# EAGLE design SparkFun_Qwiic_Accelerometer_BMA400 (EAGLE 9.6.2)
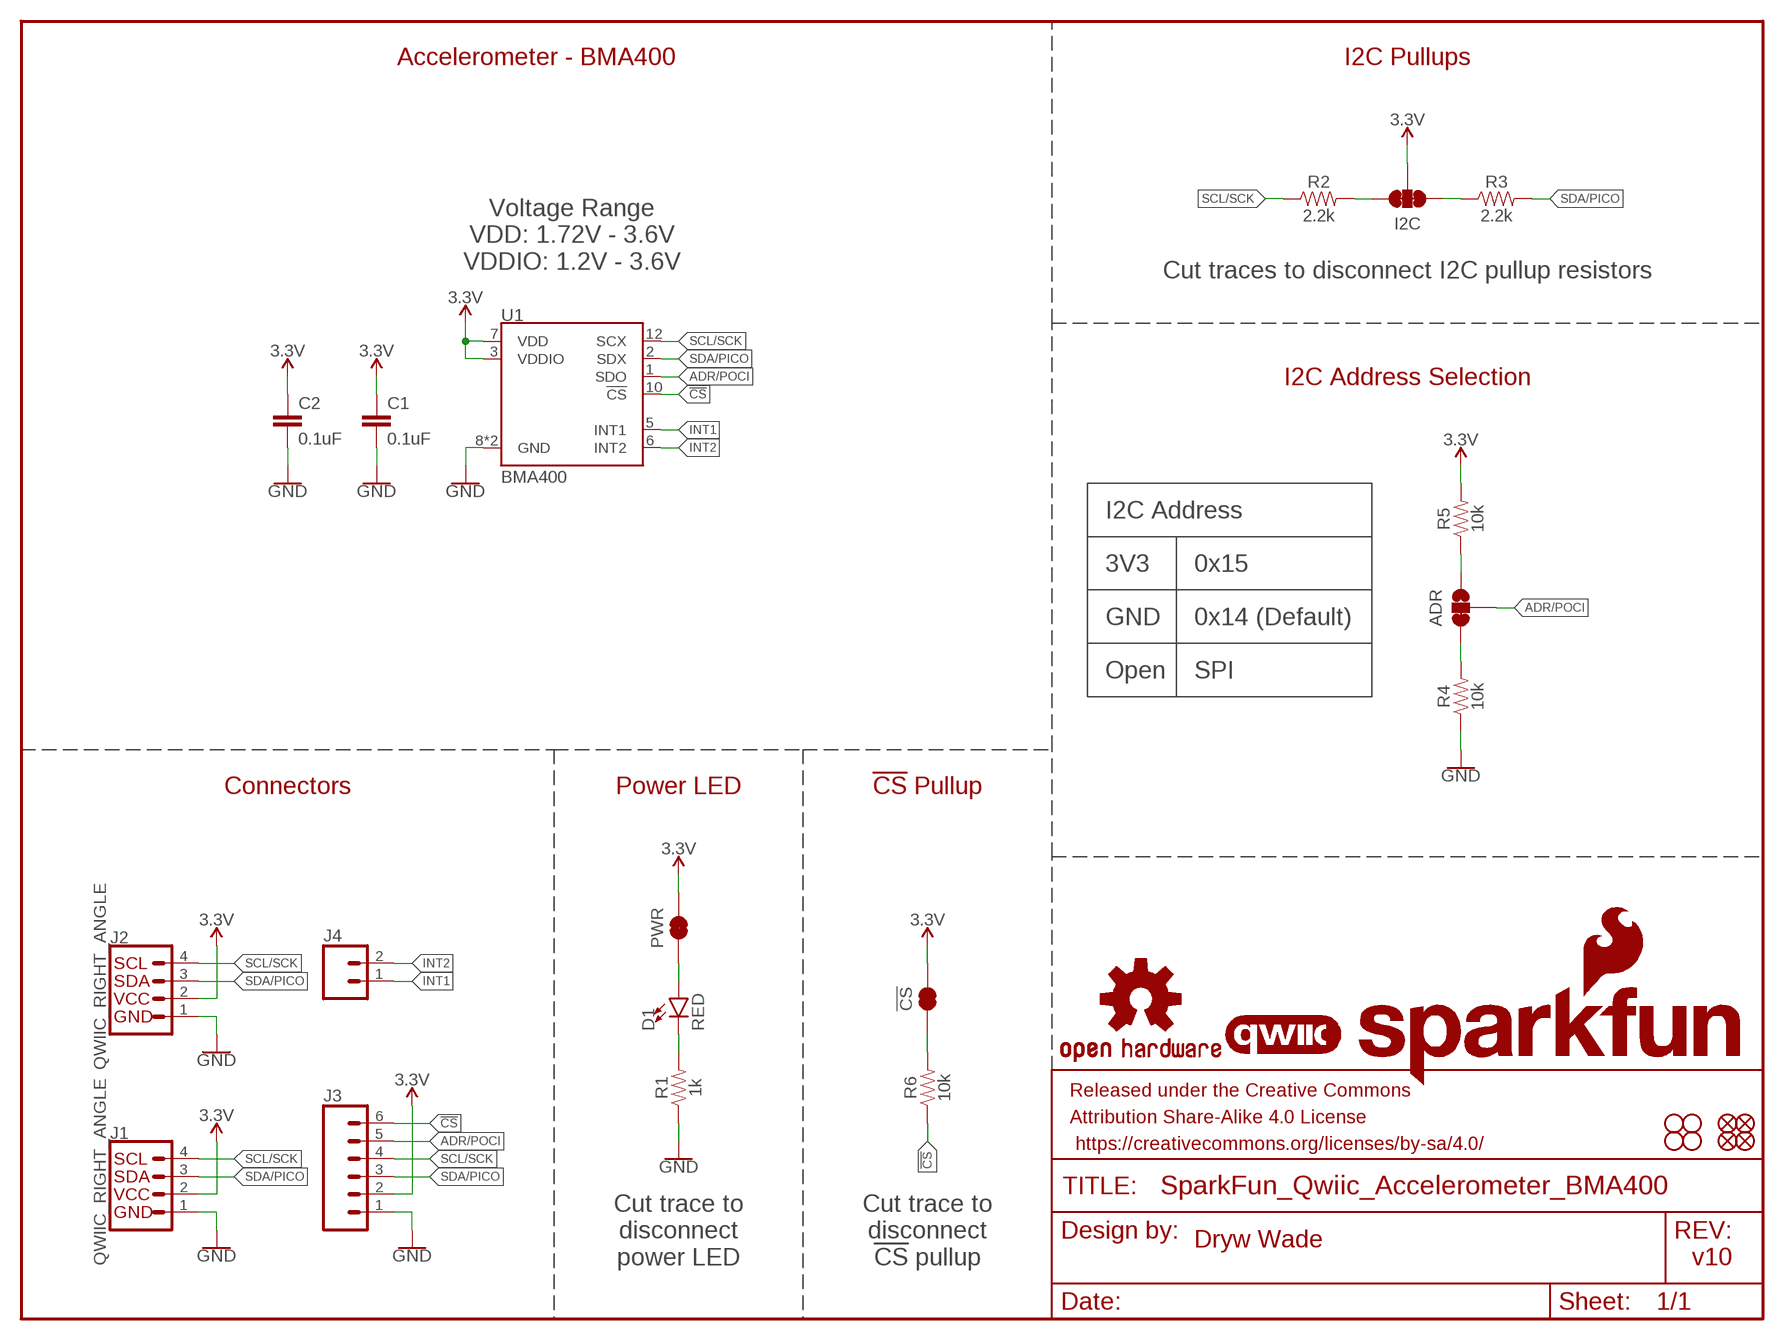
[diagram p0: schematic, sheet 1]

## Parts
!CS!  JUMPER-SMT_2_NC_TRACE_SILK  [SMT-JUMPER_2_NC_TRACE_SILK]
ADR  JUMPER-SMT_3_1-NC_TRACE_SILK  [SMT-JUMPER_3_1-NC_TRACE_SILK]
C1  0.1uF  0.1UF-0603-25V-(+80/-20%)  [0603]
C2  0.1uF  0.1UF-0603-25V-(+80/-20%)  [0603]
D1  RED  LED-RED0603  [LED-0603]
FD1  FIDUCIAL1X2  [FIDUCIAL-1X2]
FD2  FIDUCIAL1X2  [FIDUCIAL-1X2]
FD3  FIDUCIAL1X2  [FIDUCIAL-1X2]
FD4  FIDUCIAL1X2  [FIDUCIAL-1X2]
FRAME1  FRAME-LETTER  [CREATIVE_COMMONS]
H1  STAND-OFF  [STAND-OFF]
H2  STAND-OFF  [STAND-OFF]
H3  STAND-OFF  [STAND-OFF]
H4  STAND-OFF  [STAND-OFF]
I2C  JUMPER-SMT_3_2-NC_TRACE_SILK  [SMT-JUMPER_3_2-NC_TRACE_SILK]
J1  QWIIC_RIGHT_ANGLE  QWIIC_CONNECTORJS-1MM  [JST04_1MM_RA]
J2  QWIIC_RIGHT_ANGLE  QWIIC_CONNECTORJS-1MM  [JST04_1MM_RA]
J3  CONN_06NO_SILK_NO_POP  [1X06_NO_SILK]
J4  CONN_021X02_NO_SILK  [1X02_NO_SILK]
LOGO1  QWIIC_LOGO_5MM  [QWIIC_5MM]
LOGO2  SFE_LOGO_NAME_FLAME.1_INCH  [SFE_LOGO_NAME_FLAME_.1]
LOGO3  OSHW-LOGOS  [OSHW-LOGO-S]
PWR  JUMPER-SMT_2_NC_TRACE_SILK  [SMT-JUMPER_2_NC_TRACE_SILK]
R1  1k  1KOHM-0603-1/10W-1%  [0603]
R2  2.2k  2.2KOHM-0603-1/10W-1%  [0603]
R3  2.2k  2.2KOHM-0603-1/10W-1%  [0603]
R4  10k  10KOHM-0603-1/10W-1%  [0603]
R5  10k  10KOHM-0603-1/10W-1%  [0603]
R6  10k  10KOHM-0603-1/10W-1%  [0603]
U1  BMA400  [BMA400]

## Nets
3.3V: !CS!.2 C1.1 C2.1 I2C.2 J1.2 J2.2 J3.2 PWR.2 R5.2 U1.3(VDDIO) U1.7(VDD)
!CS!: J3.6 R6.1 U1.10(!CS!)
ADR/POCI: ADR.2 J3.5 U1.1(SDO)
GND: C1.2 C2.2 J1.1 J2.1 J3.1 R1.1 R4.1 U1.8(GND) U1.9(GND)
INT1: J4.1 U1.5(INT1)
INT2: J4.2 U1.6(INT2)
N$1: D1.A PWR.1
N$2: D1.C R1.2
N$3: I2C.3 R2.2
N$4: I2C.1 R3.1
N$5: ADR.1 R5.1
N$6: ADR.3 R4.2
N$7: !CS!.1 R6.2
SCL/SCK: J1.4 J2.4 J3.4 R2.1 U1.12(SCX)
SDA/PICO: J1.3 J2.3 J3.3 R3.2 U1.2(SDX)

## Notes on the sheet
- Accelerometer - BMA400 | I2C Pullups
- Voltage Range
  VDD: 1.72V - 3.6V
  VDDIO: 1.2V - 3.6V
- Cut traces to disconnect I2C pullup resistors
- I2C Address Selection
- I2C Address
- 3V3 | 0x15
- GND | 0x14 (Default)
- Open | SPI
- Connectors | Power LED | !CS! Pullup
- Cut trace to
  disconnect
  power LED
- Cut trace to
  disconnect
  !CS! pullup
- Dryw Wade
- v10

## Library data of the parts
!CS! PWR = SparkFun-Jumpers:JUMPER-SMT_2_NC_TRACE: Normally closed trace jumper This jumper has a trace between two pads so it's normally closed (NC). Use a razor knife to open the connection. For best results follow the IPC guidelines for cutting traces: Cutout at least 0.063 mm (0.005 in). Remove all loose material to clean up the cut area. Seal the cut with an approved epoxy. Reapply solder to reclose the connection.
ADR = SparkFun-Jumpers:JUMPER-SMT_3_1-NC_TRACE: Normally closed trace jumper (1 of 2 connections) This jumper has a trace between two pads so it's normally closed (NC). The other connection is normally open (NO). Use a razor knife to open the connection. For best results follow the IPC guidelines for cutting traces: Cutout at least 0.063 mm (0.005 in). Remove all loose material to clean up the cut area. Seal the cut with an approved epoxy. Reapply solder to reclose the connection, or to close the NO connection.
C1 C2 = SparkFun-Capacitors:0.1UF: 0.1µF ceramic capacitors A capacitor is a passive two-terminal electrical component used to store electrical energy temporarily in an electric field.; PROD_ID: CAP-00810
D1 = SparkFun-LED:LED-RED: Red SMD LED Used in manufacturing of most products at SparkFun Packages: 0603 - SMD 0603 package [Product Link] <http://docs.avagotech.com/docs/AV02-0551EN> 0603 SMART - SMD 0603 SMART package ( more efficient and expensive)[Product Link] <http://www.osram-os.com/Graphics/XPic2/00077099_0.pdf> 1206 - SMD1206 package [Product Link] <https://www.sparkfun.com/datasheets/DevTools/LilyPad/Q150OVS4.pdff> SparkFun Products: Pro Mini 328 -5V <https://www.sparkfun.com/products/821> RedBoard <https://www.sparkfun.com/products/12757> IOIO-OTG <https://www.sparkfun.com/products/13613>; PROD_ID: DIO-00819
FD1-FD4 = SparkFun-Aesthetics:FIDUCIAL: Fiducial Alignment Points Point-of-reference for pick-and-place machines and other optical instruments.
FRAME1 = SparkFun-Aesthetics:FRAME-LETTER: Schematic Frame - Letter Standard 8.5x11 US Letter frame
H1-H4 = SparkFun-Hardware:STAND-OFF: Stand Off Drill holes for mechanically mounting via screws, standoffs, etc. Note: Use the keepout ring to avoid running the screw head into surrounding components. Variant Overviews STAND-OFF - Mechanical footprint for a #4 phillips button head screw. STAND-OFF-TIGHT - Mechanical footprint for a #4 phillips button head screw, Example SparkFun Products Screw - Phillips Head (1/4", 4-40, 10 pack) <https://www.sparkfun.com/products/10453> (PRT-10453) Screw - Phillips Head (1/2", 4-40, 10 pack) <https://www.sparkfun.com/products/10452> (PRT-10452) Screw - Phillips Head (3/4", 4-40, 10 pack) <https://www.sparkfun.com/products/10451> (PRT-10451) Screw - Phillips Head (1", 4-40, 10 pack) <https://www.sparkfun.com/products/10450> (PRT-10450)
I2C = SparkFun-Jumpers:JUMPER-SMT_3_2-NC_TRACE: Normally closed trace jumper (2 of 2 connections) This jumper has a trace between all three pads so they are normally closed (NC). Use a razor knife to open the connection(s). For best results follow the IPC guidelines for cutting traces: Cutout at least 0.063 mm (0.005 in). Remove all loose material to clean up the cut area. Seal the cut with an approved epoxy. Reapply solder to reclose the connection(s).
J1 J2 = SparkFun-Connectors:QWIIC_CONNECTOR: SparkFun I2C Standard Qwiic Connector An SMD 1mm pitch JST connector makes it easy and quick (get it? Qwiic?) to connect I2C devices to each other. The Qwiic system <http://www.sparkfun.com/qwiic> enables fast and solderless connection between popular platforms and various sensors and actuators. We carry 200mm <https://www.sparkfun.com/products/14204>, 100mm <https://www.sparkfun.com/products/14205>, 50mm <https://www.sparkfun.com/products/14206>, and breadboard friendly <https://www.sparkfun.com/products/14207> Qwiic cables. We also offer 10 pcs strips <https://www.sparkfun.com/products/14323> the SMD connectors.; PROD_ID: CONN-13694
J3 = SparkFun-Connectors:CONN_06: Multi connection point. Often used as Generic Header-pin footprint for 0.1 inch spaced/style header connections On any of the 0.1 inch spaced packages, you can populate with these: Break Away Headers - Straight <https://www.sparkfun.com/products/116> (PRT-00116) Break Away Male Headers - Right Angle <https://www.sparkfun.com/products/553> (PRT-00553) Female Headers <https://www.sparkfun.com/products/115> (PRT-00115) Break Away Headers - Machine Pin <https://www.sparkfun.com/products/117> (PRT-00117) Break Away Female Headers - Swiss Machine Pin <https://www.sparkfun.com/products/743> (PRT-00743) Arduino Stackable Header - 6 Pin <https://www.sparkfun.com/products/9280> (PRT-09280) Screw Terminals 2.54mm Pitch (6-Pin) <https://www.sparkfun.com/products/16499> (PRT-16499) For SCREWTERMINALS and SPRING TERMINALS visit here: Screw Terimnals on SparkFun.com <https://www.sparkfun.com/search/results?term=Screw+Terminals> (5mm/3.5mm/2.54mm spacing) This device is also useful as a general connection point to wire up your design to another part of your project. Our various solder wires solder well into these plated through hole pads. Hook-Up Wire - Assortment (Stranded, 22 AWG) <https://www.sparkfun.com/products/11375> (PRT-11375) Hook-Up Wire - Assortment (Solid Core, 22 AWG) <https://www.sparkfun.com/products/11367> (PRT-11367) View the entire wire category on our website here <https://www.sparkfun.com/categories/141>
J4 = SparkFun-Connectors:CONN_02: Multi connection point. Often used as Generic Header-pin footprint for 0.1 inch spaced/style header connections On any of the 0.1 inch spaced packages, you can populate with these: Break Away Headers - Straight <https://www.sparkfun.com/products/116> (PRT-00116) Break Away Male Headers - Right Angle <https://www.sparkfun.com/products/553> (PRT-00553) Female Headers <https://www.sparkfun.com/products/115> (PRT-00115) Break Away Headers - Machine Pin <https://www.sparkfun.com/products/117> (PRT-00117) Break Away Female Headers - Swiss Machine Pin <https://www.sparkfun.com/products/743> (PRT-00743) For SCREWTERMINALS and SPRING TERMINALS visit here: Screw Terimnals on SparkFun.com <https://www.sparkfun.com/search/results?term=Screw+Terminals> (5mm/3.5mm/2.54mm spacing) This device is also useful as a general connection point to wire up your design to another part of your project. Our various solder wires solder well into these plated through hole pads. Hook-Up Wire - Assortment (Stranded, 22 AWG) <https://www.sparkfun.com/products/11375> (PRT-11375) Hook-Up Wire - Assortment (Solid Core, 22 AWG) <https://www.sparkfun.com/products/11367> (PRT-11367) View the entire wire category on our website here <https://www.sparkfun.com/categories/141> Special notes: Molex polarized connector foot print use with: PRT-08233 with associated crimp pins and housings. 2.54_SCREWTERM for use with PRT-10571. 3.5mm Screw Terminal footprints for PRT-08084 5mm Screw Terminal footprints for use with PRT-08432
LOGO1 = SparkFun-Aesthetics:QWIIC_LOGO: Qwiic Logos for placement on schematic and PCB. The 5.5mm silk logo is best for placing next to Qwiic connector.
LOGO2 = SparkFun-Aesthetics:SFE_LOGO_NAME_FLAME: SparkFun Font Logo w/ Flame This is the SparkFun full logo. The logo on the schematic will always be the same size; the package variant is the height of the flame part of the logo. Default layer for the logo on the board is tSilk.
LOGO3 = SparkFun-Aesthetics:OSHW-LOGO: Open-Source Hardware (OSHW) Logo This logo indicates the piece of hardware it is found on incorporates a OSHW license and/or adheres to the definition of open source hardware found here: http://freedomdefined.org/OSHW
R1 = SparkFun-Resistors:1KOHM: 1kΩ resistor A resistor is a passive two-terminal electrical component that implements electrical resistance as a circuit element. Resistors act to reduce current flow, and, at the same time, act to lower voltage levels within circuits. - Wikipedia; PROD_ID: RES-07856
R2 R3 = SparkFun-Resistors:2.2KOHM: 2.2kΩ resistor A resistor is a passive two-terminal electrical component that implements electrical resistance as a circuit element. Resistors act to reduce current flow, and, at the same time, act to lower voltage levels within circuits. - Wikipedia; PROD_ID: RES-08272
R4-R6 = SparkFun-Resistors:10KOHM: 10kΩ resistor A resistor is a passive two-terminal electrical component that implements electrical resistance as a circuit element. Resistors act to reduce current flow, and, at the same time, act to lower voltage levels within circuits. - Wikipedia; PROD_ID: RES-00824
U1 = SparkFun-Sensors:BMA400: Bosch BMA400 Accelerometer Senses acceleration with 12-bit resolution up to 16g, sends data out over I2C or SPI; PROD_ID: IC-17118

## Board
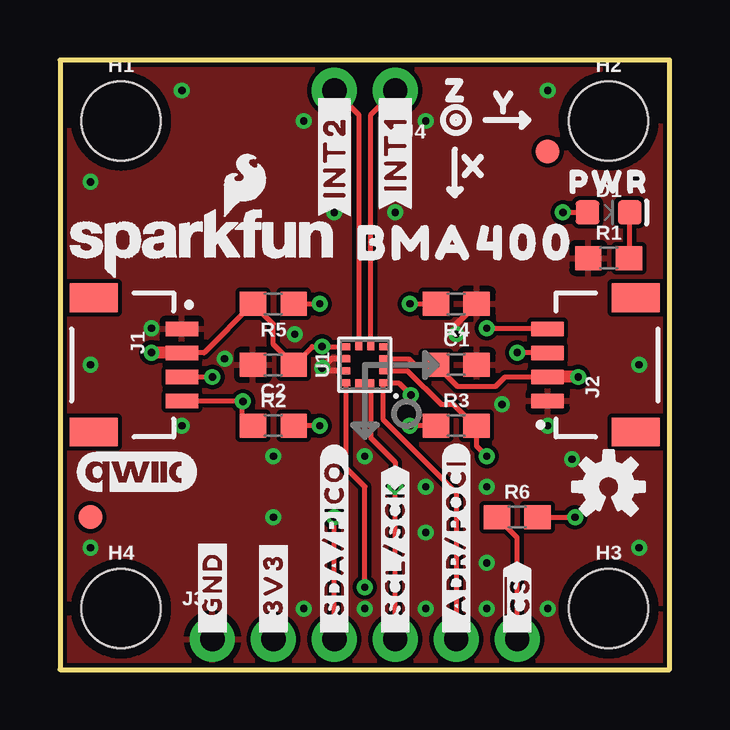
[diagram p1: board, top side]
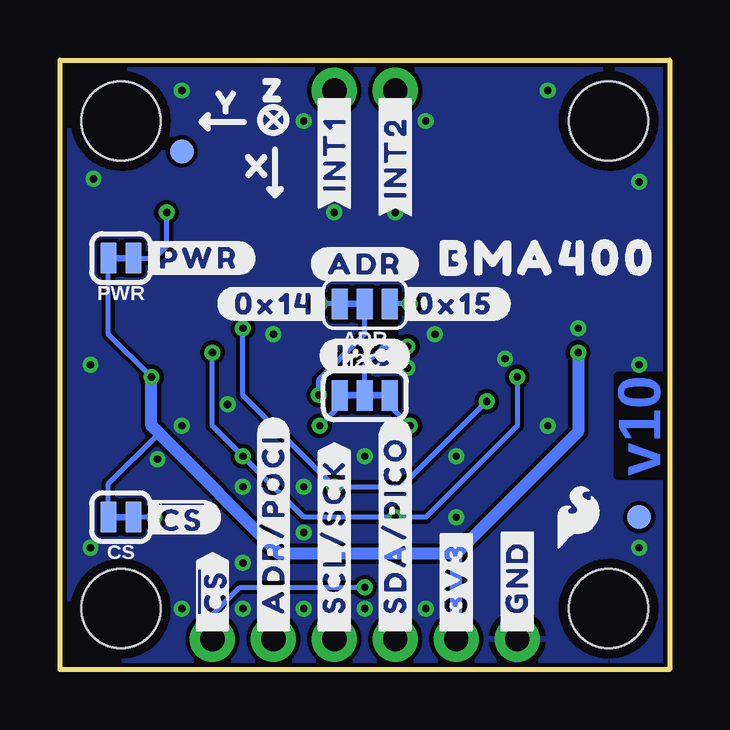
[diagram p2: board, bottom side, seen from below]

Size 25.4 x 25.4 mm. Coordinates in mm from the lower left corner, seen from the top.
Outline: 0,0 25.4,0 25.4,25.4 0,25.4 0,0
Copper layers (1*16): Top 0.035mm / dielectric 1.5mm / Bottom 0.035mm
Design rules "SparkFun-2-Layer-General-JLCPCB": minimum track width 7mil, minimum drill 0.3mm, track to track 7mil, track to pad 7mil, pad to pad 7mil, via to via 7mil, smd to smd 7mil, copper to edge 7mil, drill to drill 7mil, minimum pad ring 7mil, minimum via ring 7mil, stop-mask expansion 3mil, vias tented up to drill 25mil, thermal gap 10mil
tRestrict: area 11.9,12.7 to 12,12.8
bRestrict: area 11.4,13.7 to 11.7,14.4

### Footprints (pad centres in the part's own frame; a part is rotated, then mirrored left to right if it is on the bottom)
SMT-JUMPER_2_NC_TRACE_SILK = smd 0.66 x 1.27: 1 -0.521,0; 2 0.521,0
SMT-JUMPER_3_1-NC_TRACE_SILK = smd 0.66 x 1.27: 1 -1.041,0; 2 0,0; 3 1.041,0
0603 = smd 1.1 x 1: 1 -0.85,0; 2 0.85,0
LED-0603 = smd 1 x 1: A -0.877,0; C 0.877,0
FIDUCIAL-1X2 = smd 1 x 1: 1 0,0
STAND-OFF = hole 3.302: 0,0
SMT-JUMPER_3_2-NC_TRACE_SILK = smd 0.66 x 1.27: 1 -1.041,0; 2 0,0; 3 1.041,0
JST04_1MM_RA = smd 0.6 x 1.35: 1 -1.5,0; 2 -0.5,0; 3 0.5,0; 4 1.5,0 | smd 1.2 x 2: NC1 2.8,-3.675; NC2 -2.8,-3.675
1X06_NO_SILK = drill 1.016 pad 1.88: 1 0,0; 2 2.54,0; 3 5.08,0; 4 7.62,0; 5 10.16,0; 6 12.7,0
1X02_NO_SILK = drill 1.016 pad 1.88: 1 0,0; 2 2.54,0
BMA400 = smd 0.3 x 0.35: 1 -0.75,-0.775; 2 -0.25,-0.775; 3 0.25,-0.775; 4 0.75,-0.775; 7 0.75,0.775; 8 0.25,0.775; 9 -0.25,0.775; 10 -0.75,0.775 | smd 0.35 x 0.3: 5 0.775,-0.25; 6 0.775,0.25; 11 -0.775,0.25; 12 -0.775,-0.25

### Placement (x,y rotation side)
!CS!  22.86,6.35 180 bottom
ADR  12.7,15.24 180 bottom
C1  16.51,12.7 0 top
C2  8.89,12.7 180 top
D1  22.86,19.05 0 top
FD1  20.32,21.59 0 top
FD2  20.32,21.59 0 bottom
FD3  1.27,6.35 0 bottom
FD4  1.27,6.35 0 top
FRAME1  -10.16,-29.21 0 top  (outside the outline)
H1  2.54,22.86 0 top
H2  22.86,22.86 0 top
H3  22.86,2.54 0 top
H4  2.54,2.54 0 top
I2C  12.7,11.43 0 bottom
J1  5.08,12.7 270 top
J2  20.32,12.7 90 top
J3  6.35,1.27 0 top
J4  13.97,24.13 180 top
LOGO1  3.17,8.26 0 top
LOGO2  5.97,17.78 0 top
LOGO3  22.86,7.62 0 top
PWR  22.86,17.14 180 bottom
R1  22.86,17.14 0 top
R2  8.89,10.16 0 top
R3  16.51,10.16 0 top
R4  16.51,15.24 180 top
R5  8.89,15.24 180 top
R6  19.05,6.35 0 top
U1  12.7,12.7 90 top
U$1  [PWR0]  22.86,20.32 0 top
U$2  [X2114]  17.14,20.95 0 bottom
U$3  [Y2115]  18.41,23.62 0 bottom
U$4  [#INT1_#0]  13.97,24.13 90 top
U$5  [#INT2_#0]  11.43,24.13 90 top
U$6  [#_3V3#6]  8.89,1.27 90 top
U$7  [#_SDA#PICO#5]  11.43,1.27 90 top
U$8  [#_#CS##2]  19.05,1.27 90 top
U$9  [#_SCL#SCK#3]  13.97,1.27 90 top
U$10  [#_GND#0]  6.35,1.27 90 bottom
U$11  [#_3V3#0]  8.89,1.27 90 bottom
U$12  [#_SDA#PICO#0]  11.43,1.27 90 bottom
U$13  [#_SCL#SCK#0]  13.97,1.27 90 bottom
U$14  [#_ADR#POCI#0]  16.51,1.27 90 bottom
U$15  [#_#CS##0]  19.05,1.27 90 bottom
U$16  [#I2C#0]  12.7,13.08 0 bottom
U$17  [#ADR#0]  12.7,16.89 0 bottom
U$18  [#0X15#0]  11.3,15.24 0 bottom
U$19  [#0X14#0]  14.1,15.24 0 bottom
U$20  [#INT1_#0]  13.97,24.13 90 bottom
U$21  [#INT2_#0]  11.43,24.13 90 bottom
U$22  [#PWR#0]  21.97,17.14 0 bottom
U$23  [BMA4000]  16.89,17.78 0 top
U$24  [BMA4000]  5.08,17.14 0 bottom
U$25  [##CS##0]  21.97,6.35 0 bottom
U$26  [SFE_LOGO_FLAME_.1]  3.81,6.35 0 bottom
U$27  [#_ADR#POCI#1]  16.51,1.27 90 top
U$28  [#_GND#6]  6.35,1.27 90 top
U$29  [Z2116]  16.51,24.13 0 bottom
U$34  [X2114]  17.27,20.95 0 top
U$35  [Y2115]  18.54,23.62 0 top
U$36  [Z2116]  16.51,24.13 0 top

### Tracks (layer width: path | path; a pad name or v marks a point on that pad's centre or on a via)
3.3V  (via drill 0.3)
  Top 0.203: U1.3 14.52,12.95 14.77,12.7 C1.1 16.55,11.81 18.16,11.81 18.55,12.2 J2.2 | J1.2 6,13.2 R5.2 8.89,14.39 8.89,13.55 C2.1 10.5,13.46 v10.92,13.46 10.93,13.45 U1.7
  Top 0.508: J1.2 v3.82,13.2 v3.81,13.21 | v21.59,12.19 v21.58,12.2 J2.2
  Bottom 0.203: I2C.2 12.7,12.7 11.94,13.46 v10.92,13.46 | v21.59,12.19 23.38,13.98 PWR.2 | !CS!.2 23.38,7.73 21.27,9.84
  Bottom 0.508: v3.81,13.21 3.81,9.91 8.89,4.83 | 8.89,4.83 16.26,4.83 21.27,9.84 21.59,10.16 v21.59,12.19 | J3.2 8.89,4.83
!CS!  (via drill 0.3)
  Top 0.203: v12.7,3.43 12.7,7.62 11.93,8.39 U1.10 | J3.6 19.05,5.5 R6.1
  Bottom 0.203: J3.6 19.05,2.29 17.91,3.43 v12.7,3.43
ADR/POCI  (via drill 0.3)
  Top 0.203: J3.5 16.51,7.37 13.47,10.4 U1.1 14.11,11.95 v14.62,11.44
  Bottom 0.203: v14.62,11.44 14.62,12.08 12.7,14 ADR.2
GND  (via drill 0.3)
  Top 0.254: U1.9 11.04,12.45 v10.92,12.57 11.3,12.95 U1.8 | v16.51,13.97 16.51,14.39 R4.1
  other vias: 3.81,14.22 6.86,12.95 20.32,10.16 12.7,2.54 17.78,2.54 15.24,2.54 15.24,7.62 10.16,2.54 20.32,2.54 24.13,5.08 1.27,5.08 1.27,20.32 5.08,24.13 20.32,24.13 24,20.45 24.13,12.7 1.27,12.7 10.16,22.86 15.24,22.86 11.43,19.05 13.97,19.05 9.78,13.97 18.41,11.05 8.89,8.89 5.08,10.16 8.89,6.35 17.78,7.62 15.24,5.71 17.78,4.45 21.34,8.76 12.7,8.89
  pour Top (isolate 0.127): 0,0 25.4,0 25.4,25.4 0,25.4
  pour Bottom (isolate 0.127): 0,0 25.4,0 25.4,25.4 0,25.4
INT1
  Top 0.203: U1.5 12.95,23.11 J4.1
INT2
  Top 0.203: J4.2 12.45,23.11 U1.6
N$1  (via drill 0.3)
  Top 0.203: v20.95,19.05 D1.A
  Bottom 0.203: PWR.1 21.46,17.14 20.95,17.65 v20.95,19.05
N$2
  Top 0.203: R1.2 23.74,17.17 D1.C
N$3  (via drill 0.3)
  Top 0.203: v10.82,10.16 R2.2
  Bottom 0.203: I2C.3 11.66,11 v10.82,10.16
N$4  (via drill 0.3)
  Top 0.203: R3.1 v14.58,10.16
  Bottom 0.203: v14.58,10.16 13.74,11 I2C.1
N$5  (via drill 0.3)
  Top 0.203: R5.1 v10.82,15.24
  Bottom 0.203: v10.82,15.24 ADR.1
N$6  (via drill 0.3)
  Top 0.203: v14.58,15.24 R4.2
  Bottom 0.203: ADR.3 v14.58,15.24
N$7  (via drill 0.3)
  Top 0.203: R6.2 v21.46,6.35
  Bottom 0.203: v21.46,6.35 !CS!.1
SCL/SCK  (via drill 0.3)
  Top 0.203: J1.4 7.6,11.2 | 7.6,11.2 v7.62,11.18 | J2.4 17.8,14.2 v17.78,14.22 | J3.4 v13.97,7.62 13.97,8.64 12.95,9.66 U1.12 | R2.1 7.6,10.6 7.6,11.2
  Bottom 0.203: v17.78,14.22 17.78,11.43 v13.97,7.62 11.18,7.62 v7.62,11.18
SDA/PICO  (via drill 0.3)
  Top 0.203: J1.3 v6.34,12.2 v6.35,12.19 | J2.3 v19.06,13.2 v19.05,13.21 | J3.3 v11.43,6.35 | v17.78,8.89 17.36,9.31 R3.2 17.27,10.16 16.38,11.05 15.88,11.05 14.47,12.45 U1.2
  Bottom 0.203: v6.35,12.19 6.35,10.16 10.16,6.35 v11.43,6.35 15.24,6.35 v17.78,8.89 19.05,10.16 v19.05,13.21

### Text on the board
Bottom: v10
Measures: Units: inches
tDocu: Dryw Wade